# Altium schematic sheet SECO mobo header.SchDoc
size A4
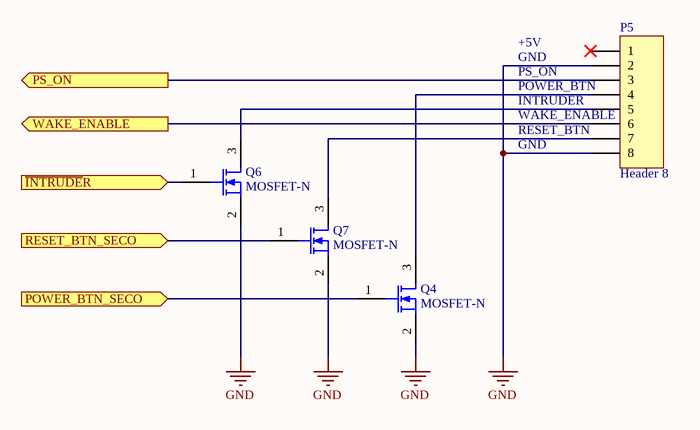
[diagram p0: SECO mobo header.SchDoc]

## Parts
P5  Header 8  [S08B-PASK-2]
Q4  MOSFET-N  [2N7002]
Q6  MOSFET-N  [2N7002]
Q7  MOSFET-N  [2N7002]

## Ports
POWER_BTN_SECO (in), PS_ON (out), RESET_BTN_SECO (in), WAKE_ENABLE (out), ~{INTRUDE}R (in)

## Nets
GND: P5.2 P5.8 Q4.2(S) Q6.2(S) Q7.2(S)
~{INTRUDE}R: Q6.1(G) ; port ~{INTRUDE}R
POWER_BTN_SECO: Q4.1(G) ; port POWER_BTN_SECO
PS_ON: P5.3 ; port PS_ON
RESET_BTN_SECO: Q7.1(G) ; port RESET_BTN_SECO
WAKE_ENABLE: P5.6 ; port WAKE_ENABLE
NetP5_4: P5.4 Q4.3(D)
NetP5_5: P5.5 Q6.3(D)
NetP5_7: P5.7 Q7.3(D)

Not connected (* = marked no-connect by the designer): P5 1*

## Notes on the sheet
- GND
- +5V
- (near P5) POWER_BTN
- (near P5) WAKE_ENABLE
- (near P5) RESET_BTN
- PS_ON
- (near P5) INTRUDER

## Library data of the parts
P5 = Header 8: Header, 8-Pin; LatestRevisionDate: 17-Jul-2002; LatestRevisionNote: Re-released for DXP Platform.; Publisher: Altium Limited; farnell: 1830753
Q4 Q6 Q7 = MOSFET-N: N-Channel MOSFET; Published: 8-Jun-2000; LatestRevisionDate: 17-Jul-2002; LatestRevisionNote: Re-released for DXP Platform.; PackageVersion: 1995/1996; PackageReference: E3; Publisher: Altium Limited; farnell: 1510761